# EAGLE board wordclock-r5-4x6 (EAGLE 5.11)
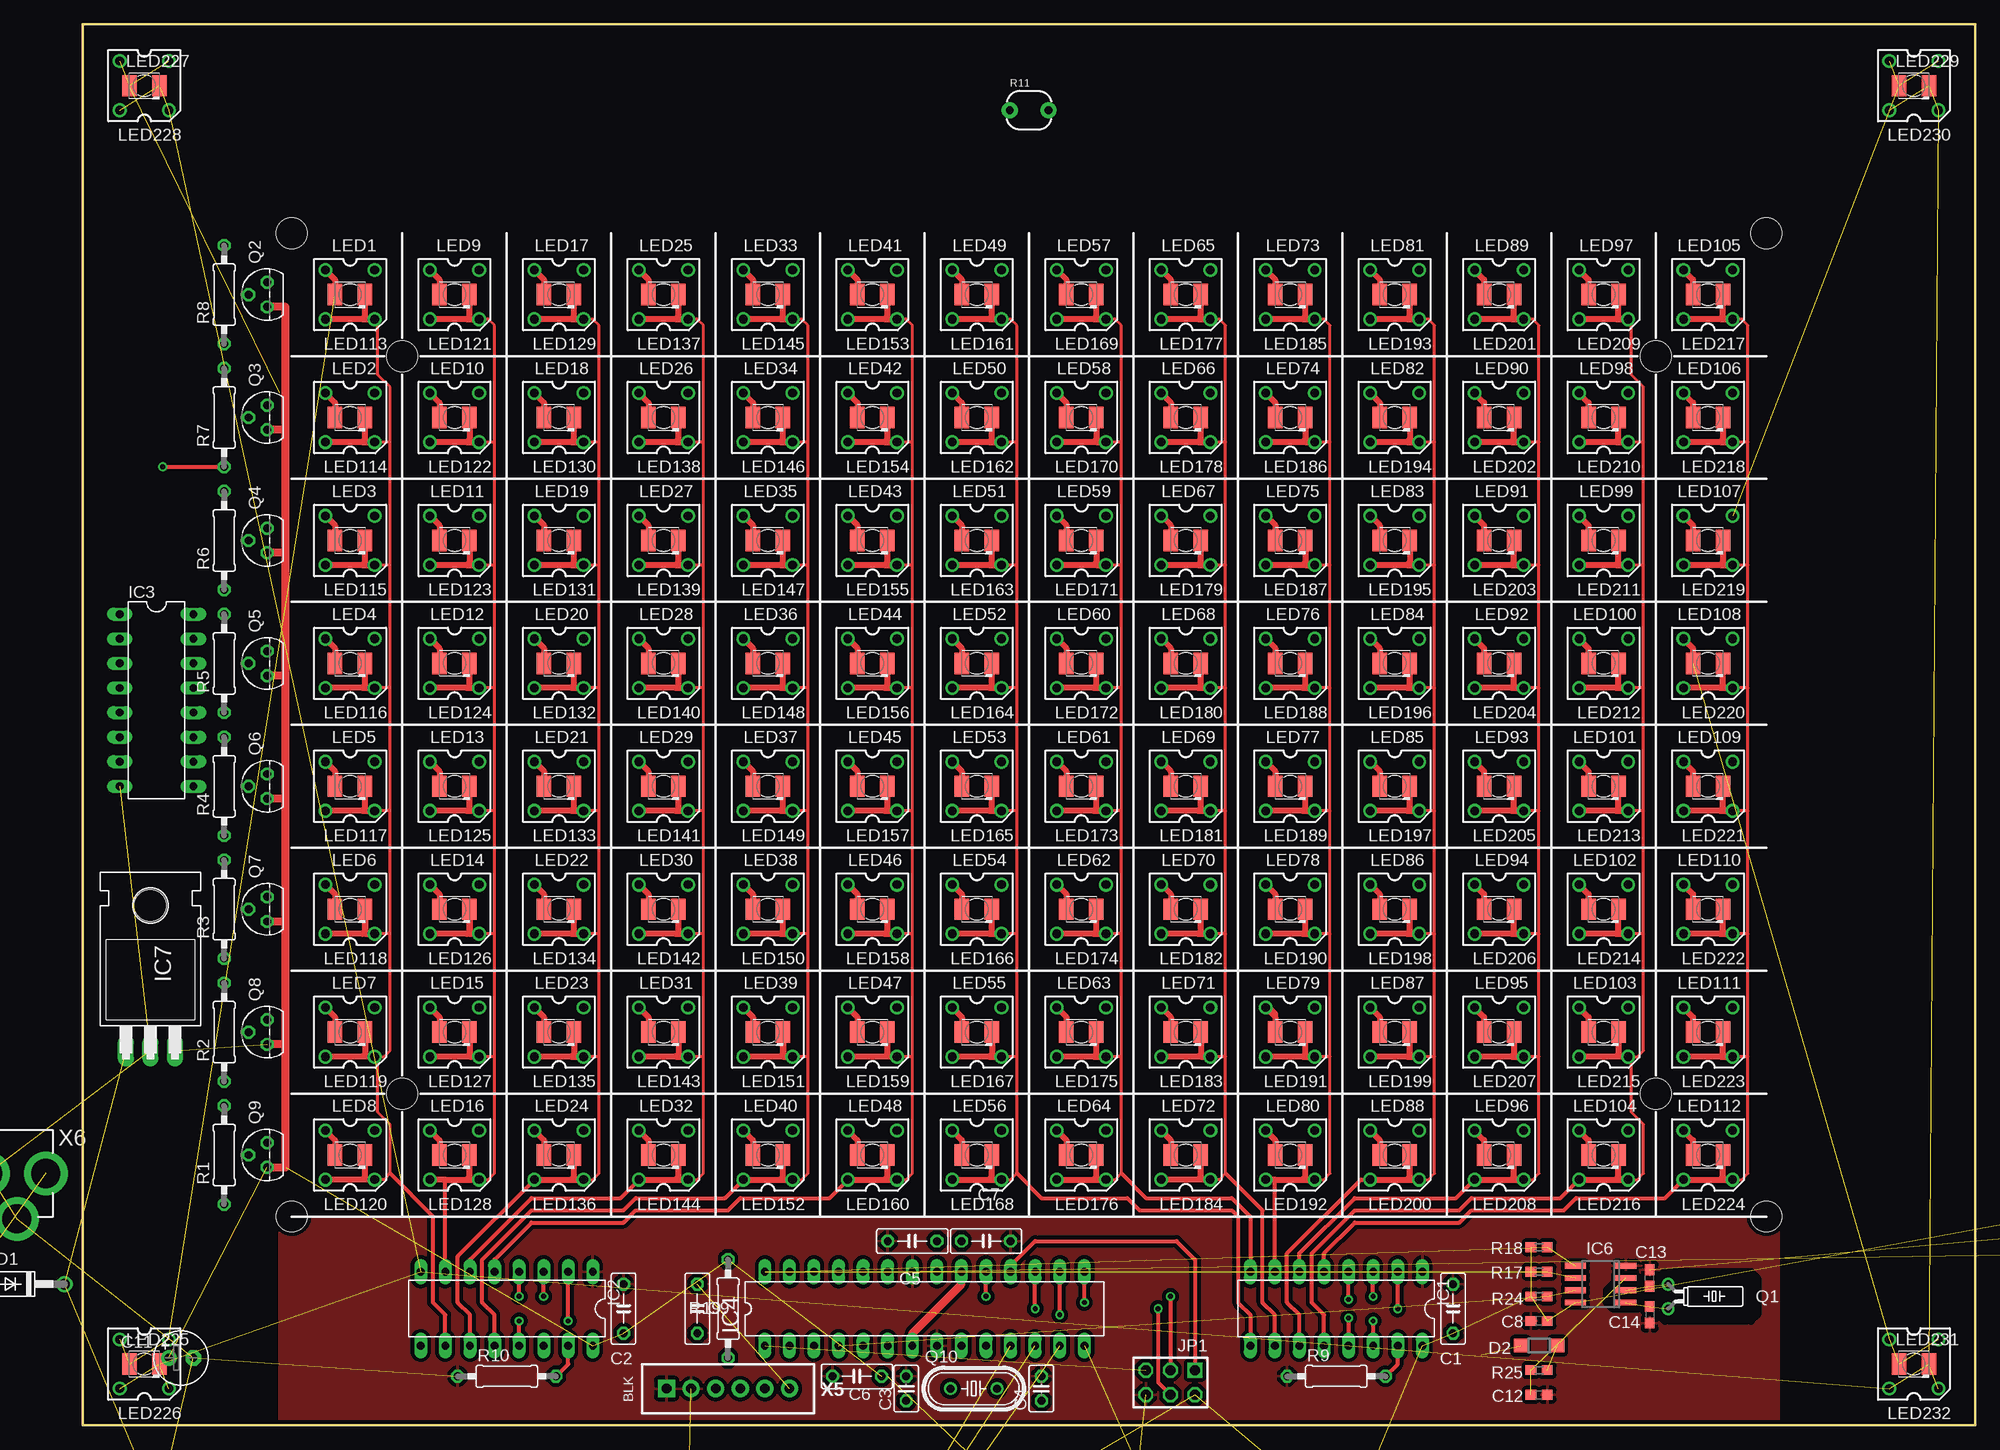
[diagram p2: board, top side]
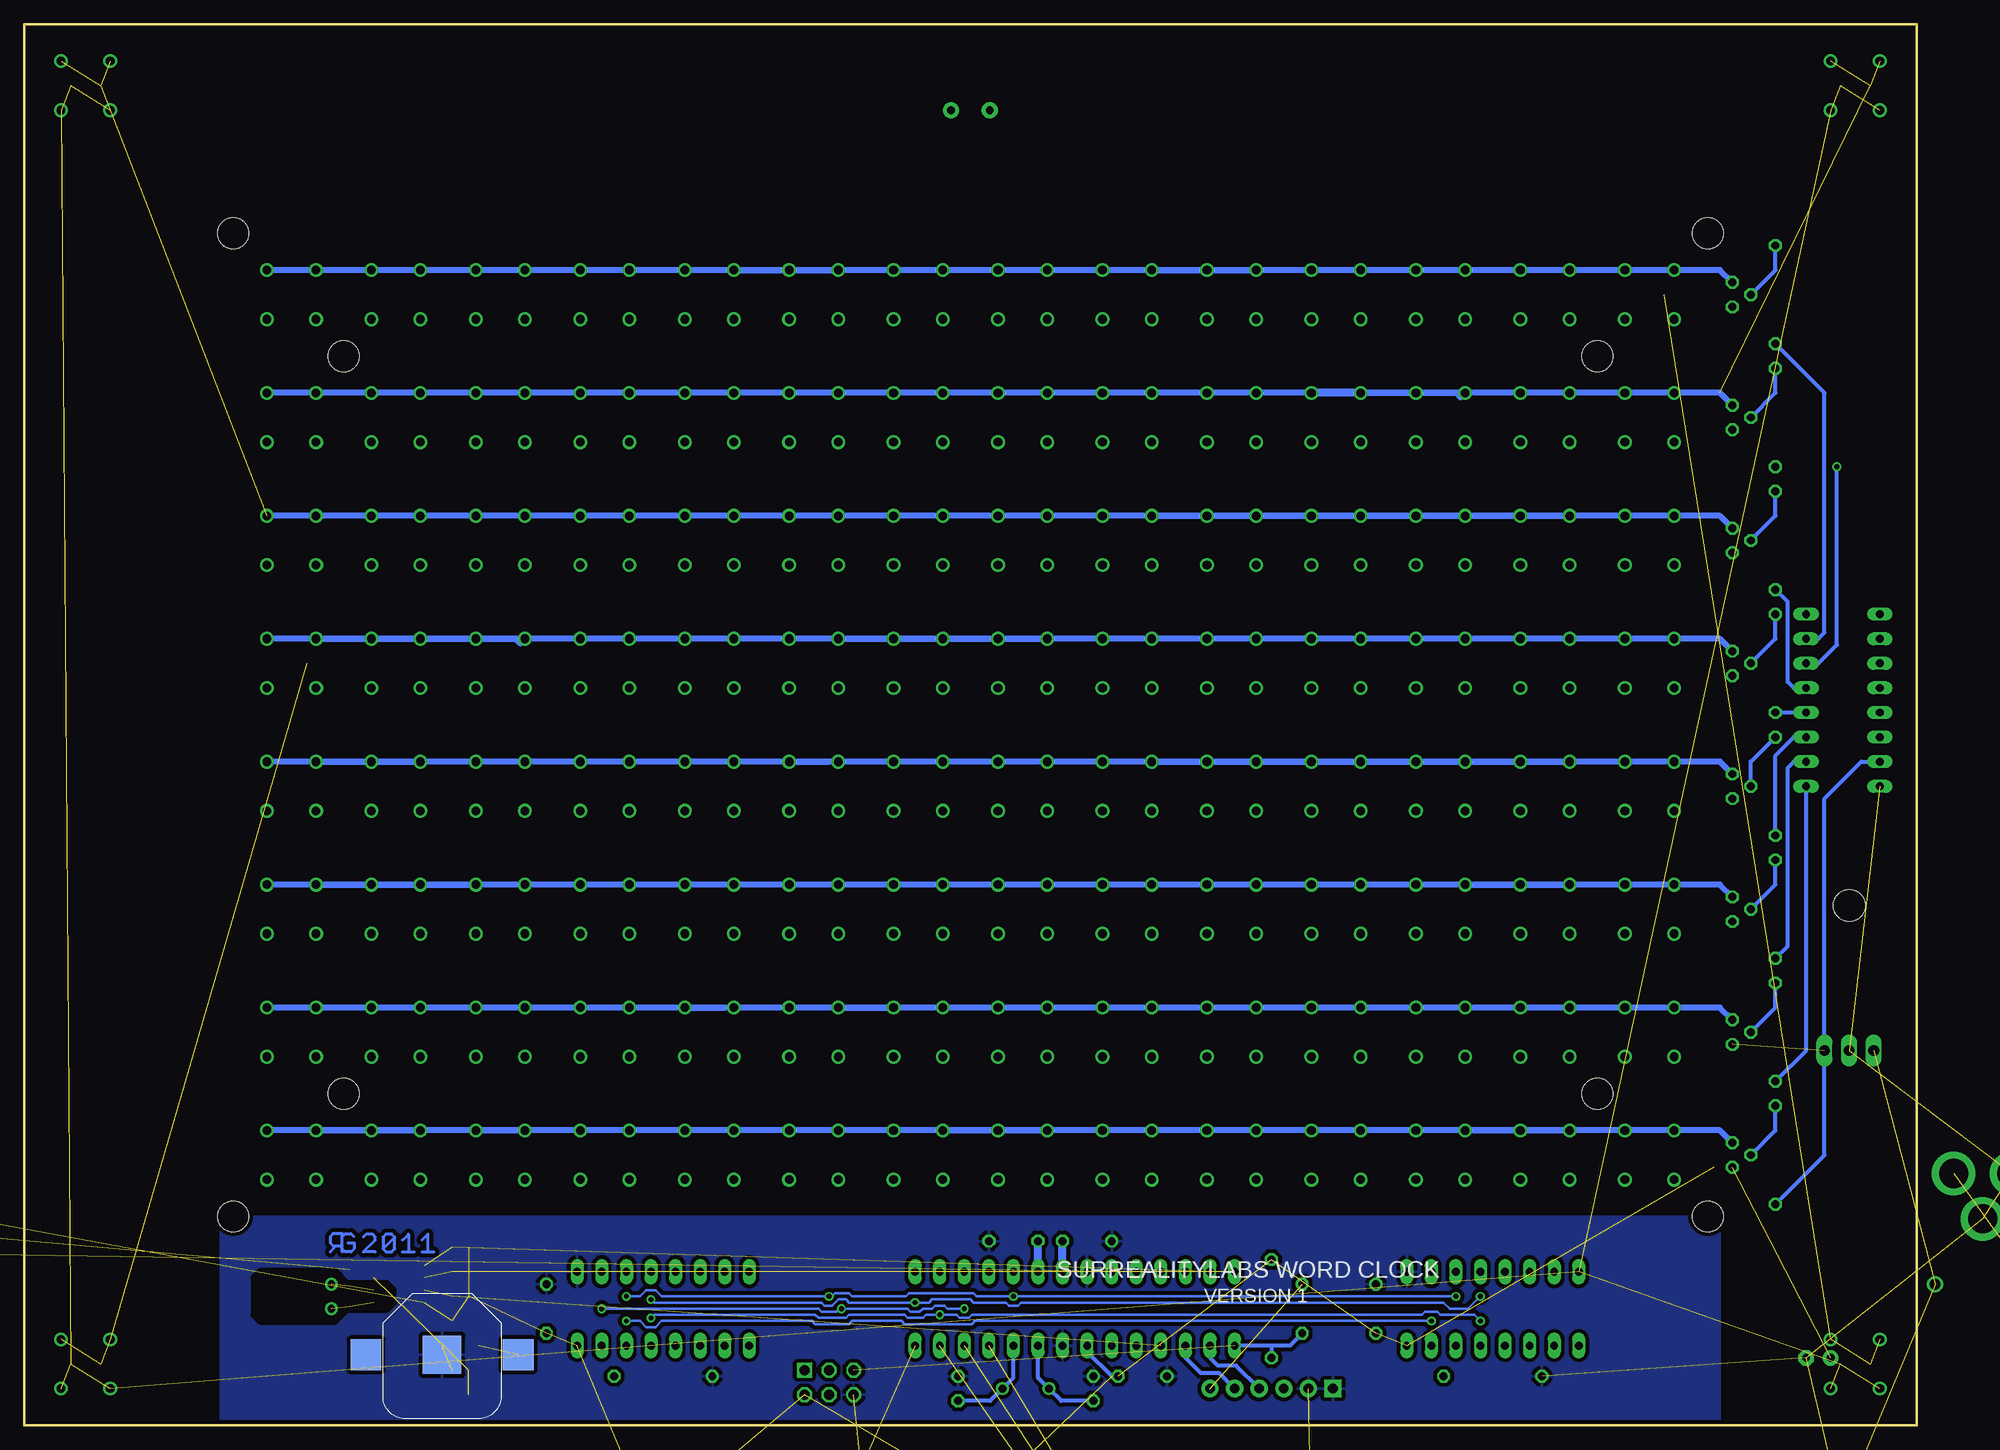
[diagram p3: board, bottom side, seen from below]

Size 195.58 x 144.78 mm. Coordinates in mm from the lower left corner, seen from the top.
Outline: 0,144.78 0,0 195.58,0 195.58,144.78 0,144.78
Copper layers (1*16): Top 0.035mm / dielectric 1.5mm / Bottom 0.035mm
Design rules "default *": minimum track width 10mil, minimum drill 19mil, track to track 10mil, track to pad 10mil, pad to pad 10mil, via to via 10mil, smd to smd 10mil, copper to edge 10mil, drill to drill 8mil, minimum pad ring 10mil, minimum via ring 8mil, stop-mask expansion 4mil, vias tented up to drill 20mil, thermal gap 16mil
Holes 3.2 mm at 21.59,123.19 173.99,123.19 173.99,21.59 21.59,21.59 33.02,34.29 162.56,34.29 162.56,110.49 33.02,110.49
tRestrict: 12 lines
bRestrict: 12 lines

## Footprints (pad centres in the part's own frame; a part is rotated, then mirrored left to right if it is on the bottom)
BATTCON_12MM = smd 3.962 x 3.962: GND 0,0 | smd 3.175 x 3.175: PWR@1 -7.874,0; PWR@2 7.874,0
C050-025X075 = drill 0.813 octagon: 1 -2.54,0; 2 2.54,0
C025-025X050 = drill 0.813 octagon: 1 -1.27,0; 2 1.27,0
C0603 = smd 1.1 x 1: 1 -0.85,0; 2 0.85,0
E3,5-8 = drill 0.813 pad 1.6 round: + -1.778,0 | drill 0.813 pad 1.6 octagon: - 1.778,0
E2,5-6 = drill 0.813 pad 1.6 round: + -1.27,0 | drill 0.813 pad 1.6 octagon: - 1.27,0
DO41-10 = drill 1.118 round: A 5.08,0; C -5.08,0
SOD123 = smd 1.4 x 1.4: A 1.9,0; C -1.9,0
DIP-16 = drill 0.813 long: 1 -8.89,-3.81; 2 -6.35,-3.81; 3 -3.81,-3.81; 4 -1.27,-3.81; 5 1.27,-3.81; 6 3.81,-3.81; 7 6.35,-3.81; 8 8.89,-3.81; 9 8.89,3.81; 10 6.35,3.81; 11 3.81,3.81; 12 1.27,3.81; 13 -1.27,3.81; 14 -3.81,3.81; 15 -6.35,3.81; 16 -8.89,3.81
DIL16 = drill 0.813 long: 1 -8.89,-3.81; 2 -6.35,-3.81; 3 -3.81,-3.81; 4 -1.27,-3.81; 5 1.27,-3.81; 6 3.81,-3.81; 7 6.35,-3.81; 8 8.89,-3.81; 9 8.89,3.81; 10 6.35,3.81; 11 3.81,3.81; 12 1.27,3.81; 13 -1.27,3.81; 14 -3.81,3.81; 15 -6.35,3.81; 16 -8.89,3.81
DIL28-3 = drill 0.813 long: 1 -16.51,-3.81; 2 -13.97,-3.81; 3 -11.43,-3.81; 4 -8.89,-3.81; 5 -6.35,-3.81; 6 -3.81,-3.81; 7 -1.27,-3.81; 8 1.27,-3.81; 9 3.81,-3.81; 10 6.35,-3.81; 11 8.89,-3.81; 12 11.43,-3.81; 13 13.97,-3.81; 14 16.51,-3.81; 15 16.51,3.81; 16 13.97,3.81; 17 11.43,3.81; 18 8.89,3.81; 19 6.35,3.81; 20 3.81,3.81; 21 1.27,3.81; 22 -1.27,3.81; 23 -3.81,3.81; 24 -6.35,3.81; 25 -8.89,3.81; 26 -11.43,3.81; 27 -13.97,3.81; 28 -16.51,3.81
SOIC8 = smd 0.6 x 2.2: 1 -1.905,-2.6; 2 -0.635,-2.6; 3 0.635,-2.6; 4 1.905,-2.6; 5 1.905,2.6; 6 0.635,2.6; 7 -0.635,2.6; 8 -1.905,2.6
TO220H = drill 1.118 long: 1 -2.54,-10.16; 2 0,-10.16; 3 2.54,-10.16 | hole 3.302: 0,4.826
AVR-ISP-6 = drill 1.016 square: 1 -2.54,-1.27 | drill 1.016 octagon: 2 -2.54,1.27; 3 0,-1.27; 4 0,1.27; 5 2.54,-1.27; 6 2.54,1.27
KA-3528ASYC = smd 1.5 x 2.2: A -1.55,0; C 1.55,0
SUPERFLUX-7.6X7.6 = drill 0.9 pad 1.422 round: 1 -2.54,2.54; 2 2.54,2.54; 3 -2.54,-2.54; 4 2.54,-2.54
TC26H = drill 0.813 round: 1 -1.27,0; 2 1.27,0
TO92 = drill 0.813 octagon: 1 1.27,0; 2 0,1.905; 3 -1.27,0
HC49/S = drill 0.813 round: 1 -2.413,0; 2 2.413,0
0207/10 = drill 0.813 octagon: 1 -5.08,0; 2 5.08,0
PHOTOCELL = drill 0.8 pad 1.676 round: 1 -2,0; 2 2,0
R0603 = smd 1.1 x 1: 1 -0.85,0; 2 0.85,0
B3F-31XX = drill 1.016 octagon: 1 -2.261,-1.245; 2 2.261,-1.245 | drill 1.499 pad 2.159 round: 3 -3.505,1.245; 4 3.505,1.245
USBCABLE-0.100-NOLBL = drill 1 pad 1.778 square: 1 0,-7.62 | drill 1 pad 1.778 round: 2 0,-5.08; 3 0,-2.54; 4 0,0; 5 0,2.54; 6 0,5.08
PJ-002 = drill 3 pad 4.5 round: 1 0,0; 2 0,6; 3 -4.7,3
22-23-2031 = drill 1 long: 1 -2.54,0; 2 0,0; 3 2.54,0

## Placement (x,y rotation side)
BAT1  [BATTCON_12MM]  152.4,7.3 180 bottom
C1  [C050-025X075]  141.6,12.06 90 top
C2  [C050-025X075]  55.88,12.06 90 top
C3  [C025-025X050]  85.09,3.81 90 top
C4  [C025-025X050]  99.06,3.81 90 top
C5  [C050-025X075]  85.73,19.05 180 top
C6  [C050-025X075]  80.01,5.08 180 top
C7  [C050-025X075]  93.34,19.05 0 top
C8  [C0603]  150.5,10.79 180 top
C9  [C050-025X075]  63.5,12.06 270 top
C10  100u  [E3,5-8]  8.25,-13.97 180 top  (outside the outline)
C11  10u  [E2,5-6]  10.16,6.98 0 top
C12  [C0603]  150.5,3.18 0 top
C13  8p  [C0603]  161.93,15.24 90 top
C14  10p  [C0603]  161.93,11.43 270 top
C15  10u  [E2,5-6]  211.46,6.98 0 top  (outside the outline)
D1  1N4004  [DO41-10]  -6.98,14.61 180 top
D2  MBR0520LT  [SOD123]  150.5,8.25 180 top
IC1  A6275EA  [DIP-16]  129.54,12.06 180 top
IC2  A6275EA  [DIP-16]  43.81,12.06 180 top
IC3  74LS138N  [DIL16]  7.62,74.93 270 top
IC4  MEGA48/88/168-PU  [DIL28-3]  87,12.06 0 top
IC6  DS1307Z  [SOIC8]  156.84,14.61 90 top
IC7  7805T  [TO220H]  6.98,48.89 0 top
JP1  AVR-ISP-6  [AVR-ISP-6]  112.4,4.45 180 top
LED1  [KA-3528ASYC]  27.62,116.84 0 top
LED2  [KA-3528ASYC]  27.62,104.14 0 top
LED3  [KA-3528ASYC]  27.62,91.44 0 top
LED4  [KA-3528ASYC]  27.62,78.74 0 top
LED5  [KA-3528ASYC]  27.62,66.04 0 top
LED6  [KA-3528ASYC]  27.62,53.34 0 top
LED7  [KA-3528ASYC]  27.62,40.64 0 top
LED8  [KA-3528ASYC]  27.62,27.94 0 top
LED9  [KA-3528ASYC]  38.42,116.84 0 top
LED10  [KA-3528ASYC]  38.42,104.14 0 top
LED11  [KA-3528ASYC]  38.42,91.44 0 top
LED12  [KA-3528ASYC]  38.42,78.74 0 top
LED13  [KA-3528ASYC]  38.42,66.04 0 top
LED14  [KA-3528ASYC]  38.42,53.34 0 top
LED15  [KA-3528ASYC]  38.42,40.64 0 top
LED16  [KA-3528ASYC]  38.42,27.94 0 top
LED17  [KA-3528ASYC]  49.21,116.84 0 top
LED18  [KA-3528ASYC]  49.21,104.14 0 top
LED19  [KA-3528ASYC]  49.21,91.44 0 top
LED20  [KA-3528ASYC]  49.21,78.74 0 top
LED21  [KA-3528ASYC]  49.21,66.04 0 top
LED22  [KA-3528ASYC]  49.21,53.34 0 top
LED23  [KA-3528ASYC]  49.21,40.64 0 top
LED24  [KA-3528ASYC]  49.21,27.94 0 top
LED25  [KA-3528ASYC]  60.01,116.84 0 top
LED26  [KA-3528ASYC]  60.01,104.14 0 top
LED27  [KA-3528ASYC]  60.01,91.44 0 top
LED28  [KA-3528ASYC]  60.01,78.74 0 top
LED29  [KA-3528ASYC]  60.01,66.04 0 top
LED30  [KA-3528ASYC]  60.01,53.34 0 top
LED31  [KA-3528ASYC]  60.01,40.64 0 top
LED32  [KA-3528ASYC]  60.01,27.94 0 top
LED33  [KA-3528ASYC]  70.8,116.84 0 top
LED34  [KA-3528ASYC]  70.8,104.14 0 top
LED35  [KA-3528ASYC]  70.8,91.44 0 top
LED36  [KA-3528ASYC]  70.8,78.74 0 top
LED37  [KA-3528ASYC]  70.8,66.04 0 top
LED38  [KA-3528ASYC]  70.8,53.34 0 top
LED39  [KA-3528ASYC]  70.8,40.64 0 top
LED40  [KA-3528ASYC]  70.8,27.94 0 top
LED41  [KA-3528ASYC]  81.6,116.84 0 top
LED42  [KA-3528ASYC]  81.6,104.14 0 top
LED43  [KA-3528ASYC]  81.6,91.44 0 top
LED44  [KA-3528ASYC]  81.6,78.74 0 top
LED45  [KA-3528ASYC]  81.6,66.04 0 top
LED46  [KA-3528ASYC]  81.6,53.34 0 top
LED47  [KA-3528ASYC]  81.6,40.64 0 top
LED48  [KA-3528ASYC]  81.6,27.94 0 top
LED49  [KA-3528ASYC]  92.39,116.84 0 top
LED50  [KA-3528ASYC]  92.39,104.14 0 top
LED51  [KA-3528ASYC]  92.39,91.44 0 top
LED52  [KA-3528ASYC]  92.39,78.74 0 top
LED53  [KA-3528ASYC]  92.39,66.04 0 top
LED54  [KA-3528ASYC]  92.39,53.34 0 top
LED55  [KA-3528ASYC]  92.39,40.64 0 top
LED56  [KA-3528ASYC]  92.39,27.94 0 top
LED57  [KA-3528ASYC]  103.19,116.84 0 top
LED58  [KA-3528ASYC]  103.19,104.14 0 top
LED59  [KA-3528ASYC]  103.19,91.44 0 top
LED60  [KA-3528ASYC]  103.19,78.74 0 top
LED61  [KA-3528ASYC]  103.19,66.04 0 top
LED62  [KA-3528ASYC]  103.19,53.34 0 top
LED63  [KA-3528ASYC]  103.19,40.64 0 top
LED64  [KA-3528ASYC]  103.19,27.94 0 top
LED65  [KA-3528ASYC]  113.98,116.84 0 top
LED66  [KA-3528ASYC]  113.98,104.14 0 top
LED67  [KA-3528ASYC]  113.98,91.44 0 top
LED68  [KA-3528ASYC]  113.98,78.74 0 top
LED69  [KA-3528ASYC]  113.98,66.04 0 top
LED70  [KA-3528ASYC]  113.98,53.34 0 top
LED71  [KA-3528ASYC]  113.98,40.64 0 top
LED72  [KA-3528ASYC]  113.98,27.94 0 top
LED73  [KA-3528ASYC]  124.78,116.84 0 top
LED74  [KA-3528ASYC]  124.78,104.14 0 top
LED75  [KA-3528ASYC]  124.78,91.44 0 top
LED76  [KA-3528ASYC]  124.78,78.74 0 top
LED77  [KA-3528ASYC]  124.78,66.04 0 top
LED78  [KA-3528ASYC]  124.78,53.34 0 top
LED79  [KA-3528ASYC]  124.78,40.64 0 top
LED80  [KA-3528ASYC]  124.78,27.94 0 top
LED81  [KA-3528ASYC]  135.57,116.84 0 top
LED82  [KA-3528ASYC]  135.57,104.14 0 top
LED83  [KA-3528ASYC]  135.57,91.44 0 top
LED84  [KA-3528ASYC]  135.57,78.74 0 top
LED85  [KA-3528ASYC]  135.57,66.04 0 top
LED86  [KA-3528ASYC]  135.57,53.34 0 top
LED87  [KA-3528ASYC]  135.57,40.64 0 top
LED88  [KA-3528ASYC]  135.57,27.94 0 top
LED89  [KA-3528ASYC]  146.37,116.84 0 top
LED90  [KA-3528ASYC]  146.37,104.14 0 top
LED91  [KA-3528ASYC]  146.37,91.44 0 top
LED92  [KA-3528ASYC]  146.37,78.74 0 top
LED93  [KA-3528ASYC]  146.37,66.04 0 top
LED94  [KA-3528ASYC]  146.37,53.34 0 top
LED95  [KA-3528ASYC]  146.37,40.64 0 top
LED96  [KA-3528ASYC]  146.37,27.94 0 top
LED97  [KA-3528ASYC]  157.16,116.84 0 top
LED98  [KA-3528ASYC]  157.16,104.14 0 top
LED99  [KA-3528ASYC]  157.16,91.44 0 top
LED100  [KA-3528ASYC]  157.16,78.74 0 top
LED101  [KA-3528ASYC]  157.16,66.04 0 top
LED102  [KA-3528ASYC]  157.16,53.34 0 top
LED103  [KA-3528ASYC]  157.16,40.64 0 top
LED104  [KA-3528ASYC]  157.16,27.94 0 top
LED105  [KA-3528ASYC]  167.96,116.84 0 top
LED106  [KA-3528ASYC]  167.96,104.14 0 top
LED107  [KA-3528ASYC]  167.96,91.44 0 top
LED108  [KA-3528ASYC]  167.96,78.74 0 top
LED109  [KA-3528ASYC]  167.96,66.04 0 top
LED110  [KA-3528ASYC]  167.96,53.34 0 top
LED111  [KA-3528ASYC]  167.96,40.64 0 top
LED112  [KA-3528ASYC]  167.96,27.94 0 top
LED113  [SUPERFLUX-7.6X7.6]  27.62,116.84 90 top
LED114  [SUPERFLUX-7.6X7.6]  27.62,104.14 90 top
LED115  [SUPERFLUX-7.6X7.6]  27.62,91.44 90 top
LED116  [SUPERFLUX-7.6X7.6]  27.62,78.74 90 top
LED117  [SUPERFLUX-7.6X7.6]  27.62,66.04 90 top
LED118  [SUPERFLUX-7.6X7.6]  27.62,53.34 90 top
LED119  [SUPERFLUX-7.6X7.6]  27.62,40.64 90 top
LED120  [SUPERFLUX-7.6X7.6]  27.62,27.94 90 top
LED121  [SUPERFLUX-7.6X7.6]  38.42,116.84 90 top
LED122  [SUPERFLUX-7.6X7.6]  38.42,104.14 90 top
LED123  [SUPERFLUX-7.6X7.6]  38.42,91.44 90 top
LED124  [SUPERFLUX-7.6X7.6]  38.42,78.74 90 top
LED125  [SUPERFLUX-7.6X7.6]  38.42,66.04 90 top
LED126  [SUPERFLUX-7.6X7.6]  38.42,53.34 90 top
LED127  [SUPERFLUX-7.6X7.6]  38.42,40.64 90 top
LED128  [SUPERFLUX-7.6X7.6]  38.42,27.94 90 top
LED129  [SUPERFLUX-7.6X7.6]  49.21,116.84 90 top
LED130  [SUPERFLUX-7.6X7.6]  49.21,104.14 90 top
LED131  [SUPERFLUX-7.6X7.6]  49.21,91.44 90 top
LED132  [SUPERFLUX-7.6X7.6]  49.21,78.74 90 top
LED133  [SUPERFLUX-7.6X7.6]  49.21,66.04 90 top
LED134  [SUPERFLUX-7.6X7.6]  49.21,53.34 90 top
LED135  [SUPERFLUX-7.6X7.6]  49.21,40.64 90 top
LED136  [SUPERFLUX-7.6X7.6]  49.21,27.94 90 top
LED137  [SUPERFLUX-7.6X7.6]  60.01,116.84 90 top
LED138  [SUPERFLUX-7.6X7.6]  60.01,104.14 90 top
LED139  [SUPERFLUX-7.6X7.6]  60.01,91.44 90 top
LED140  [SUPERFLUX-7.6X7.6]  60.01,78.74 90 top
LED141  [SUPERFLUX-7.6X7.6]  60.01,66.04 90 top
LED142  [SUPERFLUX-7.6X7.6]  60.01,53.34 90 top
LED143  [SUPERFLUX-7.6X7.6]  60.01,40.64 90 top
LED144  [SUPERFLUX-7.6X7.6]  60.01,27.94 90 top
LED145  [SUPERFLUX-7.6X7.6]  70.8,116.84 90 top
LED146  [SUPERFLUX-7.6X7.6]  70.8,104.14 90 top
LED147  [SUPERFLUX-7.6X7.6]  70.8,91.44 90 top
LED148  [SUPERFLUX-7.6X7.6]  70.8,78.74 90 top
LED149  [SUPERFLUX-7.6X7.6]  70.8,66.04 90 top
LED150  [SUPERFLUX-7.6X7.6]  70.8,53.34 90 top
LED151  [SUPERFLUX-7.6X7.6]  70.8,40.64 90 top
LED152  [SUPERFLUX-7.6X7.6]  70.8,27.94 90 top
LED153  [SUPERFLUX-7.6X7.6]  81.6,116.84 90 top
LED154  [SUPERFLUX-7.6X7.6]  81.6,104.14 90 top
LED155  [SUPERFLUX-7.6X7.6]  81.6,91.44 90 top
LED156  [SUPERFLUX-7.6X7.6]  81.6,78.74 90 top
LED157  [SUPERFLUX-7.6X7.6]  81.6,66.04 90 top
LED158  [SUPERFLUX-7.6X7.6]  81.6,53.34 90 top
LED159  [SUPERFLUX-7.6X7.6]  81.6,40.64 90 top
LED160  [SUPERFLUX-7.6X7.6]  81.6,27.94 90 top
LED161  [SUPERFLUX-7.6X7.6]  92.39,116.84 90 top
LED162  [SUPERFLUX-7.6X7.6]  92.39,104.14 90 top
LED163  [SUPERFLUX-7.6X7.6]  92.39,91.44 90 top
LED164  [SUPERFLUX-7.6X7.6]  92.39,78.74 90 top
LED165  [SUPERFLUX-7.6X7.6]  92.39,66.04 90 top
LED166  [SUPERFLUX-7.6X7.6]  92.39,53.34 90 top
LED167  [SUPERFLUX-7.6X7.6]  92.39,40.64 90 top
LED168  [SUPERFLUX-7.6X7.6]  92.39,27.94 90 top
LED169  [SUPERFLUX-7.6X7.6]  103.19,116.84 90 top
LED170  [SUPERFLUX-7.6X7.6]  103.19,104.14 90 top
LED171  [SUPERFLUX-7.6X7.6]  103.19,91.44 90 top
LED172  [SUPERFLUX-7.6X7.6]  103.19,78.74 90 top
LED173  [SUPERFLUX-7.6X7.6]  103.19,66.04 90 top
LED174  [SUPERFLUX-7.6X7.6]  103.19,53.34 90 top
LED175  [SUPERFLUX-7.6X7.6]  103.19,40.64 90 top
LED176  [SUPERFLUX-7.6X7.6]  103.19,27.94 90 top
LED177  [SUPERFLUX-7.6X7.6]  113.98,116.84 90 top
LED178  [SUPERFLUX-7.6X7.6]  113.98,104.14 90 top
LED179  [SUPERFLUX-7.6X7.6]  113.98,91.44 90 top
LED180  [SUPERFLUX-7.6X7.6]  113.98,78.74 90 top
LED181  [SUPERFLUX-7.6X7.6]  113.98,66.04 90 top
LED182  [SUPERFLUX-7.6X7.6]  113.98,53.34 90 top
LED183  [SUPERFLUX-7.6X7.6]  113.98,40.64 90 top
LED184  [SUPERFLUX-7.6X7.6]  113.98,27.94 90 top
LED185  [SUPERFLUX-7.6X7.6]  124.78,116.84 90 top
LED186  [SUPERFLUX-7.6X7.6]  124.78,104.14 90 top
LED187  [SUPERFLUX-7.6X7.6]  124.78,91.44 90 top
LED188  [SUPERFLUX-7.6X7.6]  124.78,78.74 90 top
LED189  [SUPERFLUX-7.6X7.6]  124.78,66.04 90 top
LED190  [SUPERFLUX-7.6X7.6]  124.78,53.34 90 top
LED191  [SUPERFLUX-7.6X7.6]  124.78,40.64 90 top
LED192  [SUPERFLUX-7.6X7.6]  124.78,27.94 90 top
LED193  [SUPERFLUX-7.6X7.6]  135.57,116.84 90 top
LED194  [SUPERFLUX-7.6X7.6]  135.57,104.14 90 top
LED195  [SUPERFLUX-7.6X7.6]  135.57,91.44 90 top
LED196  [SUPERFLUX-7.6X7.6]  135.57,78.74 90 top
LED197  [SUPERFLUX-7.6X7.6]  135.57,66.04 90 top
LED198  [SUPERFLUX-7.6X7.6]  135.57,53.34 90 top
LED199  [SUPERFLUX-7.6X7.6]  135.57,40.64 90 top
LED200  [SUPERFLUX-7.6X7.6]  135.57,27.94 90 top
LED201  [SUPERFLUX-7.6X7.6]  146.37,116.84 90 top
LED202  [SUPERFLUX-7.6X7.6]  146.37,104.14 90 top
LED203  [SUPERFLUX-7.6X7.6]  146.37,91.44 90 top
LED204  [SUPERFLUX-7.6X7.6]  146.37,78.74 90 top
LED205  [SUPERFLUX-7.6X7.6]  146.37,66.04 90 top
LED206  [SUPERFLUX-7.6X7.6]  146.37,53.34 90 top
LED207  [SUPERFLUX-7.6X7.6]  146.37,40.64 90 top
LED208  [SUPERFLUX-7.6X7.6]  146.37,27.94 90 top
LED209  [SUPERFLUX-7.6X7.6]  157.16,116.84 90 top
LED210  [SUPERFLUX-7.6X7.6]  157.16,104.14 90 top
LED211  [SUPERFLUX-7.6X7.6]  157.16,91.44 90 top
LED212  [SUPERFLUX-7.6X7.6]  157.16,78.74 90 top
LED213  [SUPERFLUX-7.6X7.6]  157.16,66.04 90 top
LED214  [SUPERFLUX-7.6X7.6]  157.16,53.34 90 top
LED215  [SUPERFLUX-7.6X7.6]  157.16,40.64 90 top
LED216  [SUPERFLUX-7.6X7.6]  157.16,27.94 90 top
LED217  [SUPERFLUX-7.6X7.6]  167.96,116.84 90 top
LED218  [SUPERFLUX-7.6X7.6]  167.96,104.14 90 top
LED219  [SUPERFLUX-7.6X7.6]  167.96,91.44 90 top
LED220  [SUPERFLUX-7.6X7.6]  167.96,78.74 90 top
LED221  [SUPERFLUX-7.6X7.6]  167.96,66.04 90 top
LED222  [SUPERFLUX-7.6X7.6]  167.96,53.34 90 top
LED223  [SUPERFLUX-7.6X7.6]  167.96,40.64 90 top
LED224  [SUPERFLUX-7.6X7.6]  167.96,27.94 90 top
LED225  [KA-3528ASYC]  6.35,6.35 0 top
LED226  [SUPERFLUX-7.6X7.6]  6.35,6.35 90 top
LED227  [KA-3528ASYC]  6.35,138.43 0 top
LED228  [SUPERFLUX-7.6X7.6]  6.35,138.43 90 top
LED229  [KA-3528ASYC]  189.23,138.43 0 top
LED230  [SUPERFLUX-7.6X7.6]  189.23,138.43 90 top
LED231  [KA-3528ASYC]  189.23,6.35 0 top
LED232  [SUPERFLUX-7.6X7.6]  189.23,6.35 90 top
Q1  [TC26H]  163.83,13.33 270 top
Q2  2N3906  [TO92]  19.05,116.84 90 top
Q3  2N3906  [TO92]  19.05,104.14 90 top
Q4  2N3906  [TO92]  19.05,91.44 90 top
Q5  2N3906  [TO92]  19.05,78.74 90 top
Q6  2N3906  [TO92]  19.05,66.04 90 top
Q7  2N3906  [TO92]  19.05,53.34 90 top
Q8  2N3906  [TO92]  19.05,40.64 90 top
Q9  2N3906  [TO92]  19.05,27.94 90 top
Q10  [HC49/S]  92.08,3.81 0 top
R1  [0207/10]  14.61,27.94 90 top
R2  [0207/10]  14.61,40.64 90 top
R3  [0207/10]  14.61,53.34 90 top
R4  [0207/10]  14.61,66.04 90 top
R5  [0207/10]  14.61,78.74 90 top
R6  [0207/10]  14.61,91.44 90 top
R7  [0207/10]  14.61,104.14 90 top
R8  [0207/10]  14.61,116.84 90 top
R9  [0207/10]  129.54,5.08 0 top
R10  [0207/10]  43.81,5.08 0 top
R11  PHOTOCELLPTH  [PHOTOCELL]  97.79,135.89 0 top
R17  [R0603]  150.5,15.88 180 top
R18  [R0603]  150.5,18.41 180 top
R19  [0207/10]  66.67,12.06 90 top
R20  [0207/10]  91.44,-7.62 0 top  (outside the outline)
R21  [0207/10]  91.44,-10.16 0 top  (outside the outline)
R22  [0207/10]  91.44,-12.7 0 top  (outside the outline)
R23  [0207/10]  125.73,-10.16 0 top  (outside the outline)
R24  [R0603]  150.5,13.33 180 top
R25  [R0603]  150.5,5.71 0 top
S1  [B3F-31XX]  53.34,-11.43 0 top  (outside the outline)
S2  [B3F-31XX]  64.77,-11.43 0 top  (outside the outline)
S3  [B3F-31XX]  76.2,-11.43 0 top  (outside the outline)
S4  [B3F-31XX]  110.49,-11.43 0 top  (outside the outline)
U$1  [RGLOGO_SMALL_2011]  162.56,17.78 0 bottom
U$2  [SURREALITY_LOGO_SILK]  77.47,-7.62 0 bottom  (outside the outline)
X5  TTL-232R-5VN  [USBCABLE-0.100-NOLBL]  67.94,3.81 270 top
X6  PJ-002B  [PJ-002]  -3.81,26.04 90 top  (outside the outline)
X7  22-23-2031  [22-23-2031]  209.55,20.32 270 top  (outside the outline)

## Tracks (layer width: path | path; a pad name or v marks a point on that pad's centre or on a via)
+5V  (20 unrouted)
  Top 0.813: Q2.3 20.95,115.57 20.95,102.87 | 20.95,39.37 20.95,26.67 Q9.3 | 20.95,39.37 20.95,52.07 | 20.95,52.07 20.95,64.77 | 20.95,64.77 20.95,77.47 | 20.95,77.47 20.95,90.17 | 20.95,90.17 20.95,102.87 | 20.95,39.37 Q8.3 | 20.95,52.07 Q7.3 | 20.95,64.77 Q6.3 | 20.95,77.47 Q5.3 | 20.95,90.17 Q4.3 | 20.95,102.87 Q3.3 | IC4.20 90.81,14.61 85.73,9.53 IC4.7
  Bottom 0.406: C6.1 83.19,5.08 85.73,7.62 IC4.7
  Bottom 0.813: IC4.20 C7.1
BRIGHT  (via drill 0.5)
  Top 0.406: IC2.13 v45.09,10.79 | v100.97,11.43 IC4.16 | v130.81,11.11 IC1.13
  Bottom 0.254: v45.09,10.79 45.72,11.43 49.21,11.43 49.53,11.75 50.8,11.75 51.12,11.43 97.63,11.43 97.95,11.11 98.9,11.11 99.22,11.43 v100.97,11.43 102.39,11.43 102.71,11.11 104.3,11.11 104.62,11.43 110.33,11.43 110.65,11.11 113.51,11.11 113.82,11.43 130.49,11.43 v130.81,11.11
BUTTON1  (2 unrouted)
BUTTON2  (2 unrouted)
BUTTON3  (2 unrouted)
BUTTON4  (2 unrouted)
COL1
  Top 0.305: 169.23,114.3 171.45,114.3 172.09,113.67 172.09,101.6 | 172.09,38.1 172.09,26.04 171.45,25.4 LED224.3 | 172.09,38.1 172.09,50.8 | 172.09,50.8 172.09,63.5 | 172.09,63.5 172.09,76.2 | 172.09,76.2 172.09,88.9 | 172.09,88.9 172.09,101.6 | 172.09,38.1 169.23,38.1 | 172.09,38.1 | 172.09,50.8 169.23,50.8 | 172.09,50.8 | 172.09,63.5 169.23,63.5 | 172.09,76.2 169.23,76.2 | 172.09,76.2 | LED107.C 169.51,88.94 169.55,88.9 172.09,88.9 | LED106.C 169.51,101.64 169.55,101.6 172.09,101.6
  Top 0.406: IC1.5 128.27,17.78 131.44,20.95 142.24,20.95 143.51,22.23 153.03,22.23 154.31,23.5 163.51,23.5 LED224.1
  Top 0.61: 169.23,101.6 LED218.1 | 169.23,101.6 LED218.3 | LED106.C 169.51,101.88 169.23,101.6 | 169.23,114.3 LED217.1 | 169.23,114.3 LED217.3 | LED105.C 169.51,114.58 169.23,114.3 | 169.23,50.8 LED222.1 | 169.23,50.8 LED222.3 | 169.23,38.1 LED223.1 | 169.23,38.1 LED223.3 | LED224.1 169.23,25.4 | 169.23,25.4 LED224.3 | LED110.C 169.51,51.08 169.23,50.8 | LED111.C 169.51,38.38 169.23,38.1 | LED112.C 169.51,25.68 169.23,25.4 | 169.23,88.9 LED219.3 | 169.23,88.9 LED219.1 | 169.23,76.2 LED220.1 | 169.23,76.2 LED220.3 | 169.23,63.5 LED221.1 | 169.23,63.5 LED221.3 | LED107.C 169.51,89.18 169.23,88.9 | LED108.C 169.51,76.48 169.23,76.2 | LED109.C 169.51,63.78 169.23,63.5
COL2
  Top 0.305: 158.43,114.3 160.02,114.3 160.02,108.59 161.29,107.31 161.29,101.6 | 161.29,50.8 161.29,63.5 | 161.29,63.5 161.29,76.2 | 161.29,76.2 161.29,88.9 | 161.29,88.9 161.29,101.6 | LED216.3 160.66,25.4 161.29,26.04 161.29,31.12 160.02,32.38 160.02,37.78 LED215.3 160.66,38.1 161.29,38.73 161.29,50.8 | LED216.3 | 161.29,101.6 158.43,101.6 | 161.29,101.6 | 161.29,88.9 158.43,88.9 | 161.29,88.9 | 161.29,76.2 158.43,76.2 | 161.29,63.5 158.43,63.5 | 161.29,63.5 | 161.29,50.8 158.43,50.8 | LED103.C 158.71,38.14 158.75,38.1
  Top 0.406: IC1.12 128.27,11.43 127,12.7 127,17.78 131.44,22.23 142.24,22.23 143.51,23.5 152.72,23.5 LED216.1
  Top 0.61: 158.43,101.6 LED210.1 | 158.43,101.6 LED210.3 | LED98.C 158.71,101.88 158.43,101.6 | 158.43,114.3 LED209.1 | 158.43,114.3 LED209.3 | LED97.C 158.71,114.58 158.43,114.3 | 158.43,50.8 LED214.1 | 158.43,50.8 LED214.3 | LED216.1 158.43,25.4 | 158.43,25.4 LED216.3 | 158.43,38.1 LED215.1 | 158.43,38.1 158.75,38.1 LED215.3 | LED102.C 158.71,51.08 158.43,50.8 | LED103.C 158.71,38.38 158.43,38.1 | LED104.C 158.71,25.68 158.43,25.4 | 158.43,88.9 LED211.1 | 158.43,88.9 LED211.3 | 158.43,63.5 LED213.1 | 158.43,63.5 LED213.3 | 158.43,76.2 LED212.1 | 158.43,76.2 LED212.3 | LED101.C 158.71,63.78 158.43,63.5 | LED100.C 158.71,76.48 158.43,76.2 | LED99.C 158.71,89.18 158.43,88.9
COL3
  Top 0.305: 147.64,114.3 149.86,114.3 150.5,113.67 150.5,101.6 | 150.5,38.1 150.5,26.04 149.86,25.4 LED208.3 | 150.5,38.1 150.5,50.8 | 150.5,50.8 150.5,63.5 | 150.5,63.5 150.5,76.2 | 150.5,76.2 150.5,88.9 | 150.5,88.9 150.5,101.6 | 150.5,101.6 147.64,101.6 | 150.5,88.9 147.64,88.9 | 150.5,76.2 147.64,76.2 | 150.5,63.5 147.64,63.5 | 150.5,63.5 | 150.5,50.8 147.64,50.8 | LED95.C 147.92,38.14 147.95,38.1 150.5,38.1
  Top 0.406: IC1.6 125.73,17.78 131.44,23.5 141.92,23.5 LED208.1
  Top 0.61: 147.64,114.3 LED201.1 | 147.64,114.3 LED201.3 | LED89.C 147.92,114.58 147.64,114.3 | 147.64,101.6 LED202.1 | 147.64,101.6 LED202.3 | LED90.C 147.92,101.88 147.64,101.6 | 147.64,50.8 LED206.1 | 147.64,50.8 LED206.3 | LED208.1 147.64,25.4 | 147.64,25.4 LED208.3 | 147.64,38.1 LED207.1 | 147.64,38.1 LED207.3 | LED94.C 147.92,51.08 147.64,50.8 | LED95.C 147.92,38.38 147.64,38.1 | LED96.C 147.92,25.68 147.64,25.4 | 147.64,88.9 LED203.1 | 147.64,88.9 LED203.3 | 147.64,76.2 LED204.1 | 147.64,76.2 LED204.3 | 147.64,63.5 LED205.1 | 147.64,63.5 LED205.3 | LED91.C 147.92,89.18 147.64,88.9 | LED92.C 147.92,76.48 147.64,76.2 | LED93.C 147.92,63.78 147.64,63.5
COL4
  Top 0.305: 136.84,114.3 139.06,114.3 139.7,113.67 139.7,101.6 | 139.7,38.1 139.7,26.04 139.06,25.4 LED200.3 | 139.7,38.1 139.7,50.8 | 139.7,50.8 139.7,63.5 | 139.7,63.5 139.7,76.2 | 139.7,76.2 139.7,88.9 | 139.7,88.9 139.7,101.6 | 139.7,38.1 136.84,38.1 | 139.7,50.8 136.84,50.8 | 139.7,63.5 136.84,63.5 | 139.7,76.2 136.84,76.2 | LED83.C 137.12,88.94 137.16,88.9 139.7,88.9 | LED82.C 137.12,101.64 137.16,101.6 139.7,101.6
  Top 0.406: IC1.11 125.73,11.43 124.46,12.7 124.46,17.78 132.08,25.4 LED200.1 | LED200.1
  Top 0.61: 136.84,101.6 LED194.1 | 136.84,101.6 LED194.3 | LED82.C 137.12,101.88 136.84,101.6 | 136.84,114.3 LED193.1 | 136.84,114.3 LED193.3 | LED81.C 137.12,114.58 136.84,114.3 | LED200.1 136.84,25.4 | 136.84,25.4 LED200.3 | 136.84,38.1 LED199.1 | 136.84,38.1 LED199.3 | 136.84,50.8 LED198.1 | 136.84,50.8 LED198.3 | LED86.C 137.12,51.08 136.84,50.8 | LED87.C 137.12,38.38 136.84,38.1 | LED88.C 137.12,25.68 136.84,25.4 | 136.84,88.9 LED195.1 | 136.84,88.9 LED195.3 | 136.84,63.5 LED197.1 | 136.84,63.5 LED197.3 | 136.84,76.2 LED196.1 | 136.84,76.2 LED196.3 | LED85.C 137.12,63.78 136.84,63.5 | LED84.C 137.12,76.48 136.84,76.2 | LED83.C 137.12,89.18 136.84,88.9
COL5
  Top 0.305: 126.05,114.3 128.27,114.3 128.91,113.67 128.91,101.6 | 128.91,38.1 128.91,26.04 128.27,25.4 LED192.3 | 128.91,38.1 128.91,50.8 | 128.91,50.8 128.91,63.5 | 128.91,63.5 128.91,76.2 | 128.91,76.2 128.91,88.9 | 128.91,88.9 128.91,101.6 | LED192.3 | 128.91,38.1 126.05,38.1 | 128.91,38.1 | 128.91,50.8 126.05,50.8 | 128.91,50.8 | 128.91,63.5 126.05,63.5 | 128.91,76.2 126.05,76.2 | LED75.C 126.33,88.94 126.37,88.9 128.91,88.9 | LED74.C 126.33,101.64 126.37,101.6 128.91,101.6
  Top 0.406: IC1.7 123.19,25.4
  Top 0.61: 126.05,101.6 LED186.1 | 126.05,101.6 126.37,101.6 LED186.3 | 126.05,114.3 LED185.1 | 126.05,114.3 LED185.3 | LED73.C 126.33,114.58 126.05,114.3 | LED74.C 126.33,101.88 126.05,101.6 | LED192.1 123.19,25.4 126.05,25.4 | 126.05,25.4 LED192.3 | 126.05,38.1 LED191.1 | 126.05,38.1 LED191.3 | 126.05,50.8 LED190.1 | 126.05,50.8 LED190.3 | LED78.C 126.33,51.08 126.05,50.8 | LED79.C 126.33,38.38 126.05,38.1 | LED80.C 126.33,25.68 126.05,25.4 | 126.05,88.9 LED187.1 | 126.05,88.9 126.37,88.9 LED187.3 | 126.05,76.2 LED188.1 | 126.05,76.2 LED188.3 | 126.05,63.5 LED189.1 | 126.05,63.5 LED189.3 | LED75.C 126.33,89.18 126.05,88.9 | LED76.C 126.33,76.48 126.05,76.2 | LED77.C 126.33,63.78 126.05,63.5
COL6
  Top 0.305: 115.25,114.3 117.48,114.3 118.11,113.67 118.11,101.6 | 118.11,38.1 118.11,26.04 117.48,25.4 LED184.3 | 118.11,38.1 118.11,50.8 | 118.11,50.8 118.11,63.5 | 118.11,63.5 118.11,76.2 | 118.11,76.2 118.11,88.9 | 118.11,88.9 118.11,101.6 | 118.11,101.6 115.25,101.6 | 118.11,88.9 115.25,88.9 | 118.11,88.9 | 118.11,76.2 115.25,76.2 | 118.11,76.2 | 118.11,63.5 115.25,63.5 | 118.11,63.5 | 118.11,50.8 115.25,50.8 | LED71.C 115.53,38.14 115.57,38.1 118.11,38.1
  Top 0.406: IC1.10 123.19,11.43 121.92,12.7 121.92,22.23 118.11,26.04
  Top 0.61: 115.25,101.6 LED178.1 | 115.25,101.6 LED178.3 | LED66.C 115.53,101.88 115.25,101.6 | 115.25,114.3 LED177.1 | 115.25,114.3 LED177.3 | LED65.C 115.53,114.58 115.25,114.3 | 115.25,25.4 LED184.1 | LED184.3 115.25,25.4 | 115.25,38.1 LED183.1 | 115.25,38.1 115.57,38.1 LED183.3 | 115.25,50.8 LED182.1 | 115.25,50.8 LED182.3 | LED70.C 115.53,51.08 115.25,50.8 | LED71.C 115.53,38.38 115.25,38.1 | LED72.C 115.53,25.68 115.25,25.4 | 115.25,63.5 LED181.1 | 115.25,63.5 LED181.3 | 115.25,76.2 LED180.1 | 115.25,76.2 LED180.3 | 115.25,88.9 LED179.1 | 115.25,88.9 LED179.3 | LED67.C 115.53,89.18 115.25,88.9 | LED68.C 115.53,76.48 115.25,76.2 | LED69.C 115.53,63.78 115.25,63.5
COL7
  Top 0.305: 104.46,114.3 106.68,114.3 107.31,113.67 107.31,101.6 | 107.31,38.1 107.31,26.04 106.68,25.4 LED176.3 | 107.31,38.1 107.31,50.8 | 107.31,50.8 107.31,63.5 | 107.31,63.5 107.31,76.2 | 107.31,76.2 107.31,88.9 | 107.31,88.9 107.31,101.6 | 107.31,38.1 104.46,38.1 | 107.31,38.1 | 107.31,50.8 104.46,50.8 | 107.31,50.8 | 107.31,63.5 104.46,63.5 | 107.31,76.2 104.46,76.2 | LED59.C 104.74,88.94 104.78,88.9 107.31,88.9 | LED58.C 104.74,101.64 104.78,101.6 107.31,101.6
  Top 0.406: IC1.8 120.65,21.59 118.75,23.5 109.86,23.5 107.31,26.04
  Top 0.61: 104.46,114.3 LED169.1 | 104.46,114.3 LED169.3 | LED57.C 104.74,114.58 104.46,114.3 | 104.46,101.6 LED170.1 | 104.46,101.6 104.78,101.6 LED170.3 | LED58.C 104.74,101.88 104.46,101.6 | LED176.1 104.46,25.4 | 104.46,25.4 LED176.3 | 104.46,38.1 LED175.1 | 104.46,38.1 LED175.3 | 104.46,50.8 LED174.1 | 104.46,50.8 LED174.3 | LED62.C 104.74,51.08 104.46,50.8 | LED63.C 104.74,38.38 104.46,38.1 | LED64.C 104.74,25.68 104.46,25.4 | 104.46,63.5 LED173.1 | 104.46,63.5 LED173.3 | 104.46,88.9 LED171.1 | 104.46,88.9 104.78,88.9 LED171.3 | 104.46,76.2 LED172.1 | 104.46,76.2 LED172.3 | LED59.C 104.74,89.18 104.46,88.9 | LED60.C 104.74,76.48 104.46,76.2 | LED61.C 104.74,63.78 104.46,63.5
COL8
  Top 0.305: 93.66,114.3 95.89,114.3 96.52,113.67 96.52,101.6 | 96.52,38.1 96.52,26.04 95.89,25.4 LED168.3 | 96.52,38.1 96.52,50.8 | 96.52,50.8 96.52,63.5 | 96.52,63.5 96.52,76.2 | 96.52,76.2 96.52,88.9 | 96.52,88.9 96.52,101.6 | LED168.3 | 96.52,101.6 93.66,101.6 | 96.52,88.9 93.66,88.9 | 96.52,76.2 93.66,76.2 | 96.52,63.5 93.66,63.5 | 96.52,63.5 | 96.52,50.8 93.66,50.8 | 96.52,50.8 | LED55.C 93.94,38.14 93.98,38.1 96.52,38.1
  Top 0.406: IC1.9 120.65,11.43 119.38,12.7 119.38,21.59 118.75,22.23 109.22,22.23 107.95,23.5 99.06,23.5 96.52,26.04
  Top 0.61: 93.66,101.6 LED162.1 | 93.66,101.6 LED162.3 | LED50.C 93.94,101.88 93.66,101.6 | 93.66,114.3 LED161.1 | 93.66,114.3 LED161.3 | LED49.C 93.94,114.58 93.66,114.3 | LED168.1 93.66,25.4 | 93.66,25.4 LED168.3 | 93.66,38.1 LED167.1 | 93.66,38.1 LED167.3 | 93.66,50.8 LED166.1 | 93.66,50.8 LED166.3 | LED54.C 93.94,51.08 93.66,50.8 | LED55.C 93.94,38.38 93.66,38.1 | LED56.C 93.94,25.68 93.66,25.4 | 93.66,63.5 LED165.1 | 93.66,63.5 LED165.3 | 93.66,76.2 LED164.1 | 93.66,76.2 LED164.3 | 93.66,88.9 LED163.1 | 93.66,88.9 LED163.3 | LED51.C 93.94,89.18 93.66,88.9 | LED52.C 93.94,76.48 93.66,76.2 | LED53.C 93.94,63.78 93.66,63.5
COL9
  Top 0.305: 82.87,114.3 85.09,114.3 85.73,113.67 85.73,101.6 | 85.73,38.1 85.73,26.04 85.09,25.4 LED160.3 | 85.73,38.1 85.73,50.8 | 85.73,50.8 85.73,63.5 | 85.73,63.5 85.73,76.2 | 85.73,76.2 85.73,88.9 | 85.73,88.9 85.73,101.6 | 85.73,38.1 LED159.3 | 85.73,38.1 | 85.73,50.8 82.87,50.8 | 85.73,63.5 82.87,63.5 | 85.73,76.2 82.87,76.2 | 85.73,76.2 | 85.73,101.6 82.87,101.6 | 85.73,88.9 82.87,88.9
  Top 0.406: IC2.5 42.55,17.14 46.36,20.95 55.88,20.95 57.15,22.23 66.67,22.23 67.94,23.5 77.15,23.5 LED160.1
  Top 0.61: 82.87,101.6 LED154.1 | 82.87,101.6 LED154.3 | 82.87,114.3 LED153.1 | 82.87,114.3 LED153.3 | LED41.C 83.15,114.58 82.87,114.3 | LED42.C 83.15,101.88 82.87,101.6 | 82.87,50.8 LED158.1 | 82.87,50.8 LED158.3 | 82.87,38.1 LED159.1 | LED159.3 82.87,38.1 | LED160.1 82.87,25.4 | 82.87,25.4 LED160.3 | LED46.C 83.15,51.08 82.87,50.8 | LED47.C 83.15,38.38 82.87,38.1 | LED48.C 83.15,25.68 82.87,25.4 | 82.87,63.5 LED157.1 | 82.87,63.5 LED157.3 | 82.87,88.9 LED155.1 | 82.87,88.9 LED155.3 | 82.87,76.2 LED156.1 | 82.87,76.2 LED156.3 | LED43.C 83.15,89.18 82.87,88.9 | LED44.C 83.15,76.48 82.87,76.2 | LED45.C 83.15,63.78 82.87,63.5
COL10
  Top 0.305: 72.07,114.3 74.3,114.3 74.93,113.67 74.93,101.6 | 74.93,38.1 74.93,26.04 74.3,25.4 LED152.3 | 74.93,38.1 74.93,50.8 | 74.93,50.8 74.93,63.5 | 74.93,63.5 74.93,76.2 | 74.93,76.2 74.93,88.9 | 74.93,88.9 74.93,101.6 | 74.93,101.6 72.07,101.6 | 74.93,88.9 72.07,88.9 | 74.93,88.9 | 74.93,76.2 72.07,76.2 | 74.93,76.2 | 74.93,63.5 72.07,63.5 | 74.93,63.5 | 74.93,50.8 72.07,50.8 | 74.93,50.8 | 74.93,38.1 72.39,38.1
  Top 0.406: IC2.12 42.55,11.43 41.27,12.7 41.27,17.14 46.36,22.23 55.88,22.23 57.15,23.5 66.36,23.5 LED152.1
  Top 0.61: 72.07,114.3 LED145.1 | 72.07,114.3 LED145.3 | LED33.C 72.35,114.58 72.07,114.3 | 72.07,101.6 LED146.1 | 72.07,101.6 LED146.3 | LED34.C 72.35,101.88 72.07,101.6 | 72.07,50.8 LED150.1 | 72.07,50.8 LED150.3 | 72.07,38.1 LED151.1 | 72.39,38.1 72.07,38.1 | 72.39,38.1 LED151.3 | LED152.1 72.07,25.4 | 72.07,25.4 LED152.3 | LED38.C 72.35,51.08 72.07,50.8 | 72.07,38.1 72.35,38.38 LED39.C 72.35,38.14 72.39,38.1 | LED40.C 72.35,25.68 72.07,25.4 | 72.07,63.5 LED149.1 | 72.07,63.5 LED149.3 | 72.07,76.2 LED148.1 | 72.07,76.2 LED148.3 | 72.07,88.9 LED147.1 | 72.07,88.9 LED147.3 | LED37.C 72.35,63.78 72.07,63.5 | LED36.C 72.35,76.48 72.07,76.2 | LED35.C 72.35,89.18 72.07,88.9
COL11
  Top 0.305: 61.28,114.3 63.5,114.3 64.14,113.67 64.14,101.6 | 64.14,38.1 64.14,26.04 63.5,25.4 LED144.3 | 64.14,38.1 64.14,50.8 | 64.14,50.8 64.14,63.5 | 64.14,63.5 64.14,76.2 | 64.14,76.2 64.14,88.9 | 64.14,88.9 64.14,101.6 | LED144.3 | 64.14,101.6 61.28,101.6 | 64.14,88.9 61.28,88.9 | 64.14,88.9 | 64.14,76.2 61.28,76.2 | 64.14,63.5 61.28,63.5 | 64.14,63.5 | 63.5,50.8 61.28,50.8 | 63.5,50.8 | 64.14,50.8 63.5,50.8 | LED31.C 61.56,38.14 61.59,38.1 64.14,38.1
  Top 0.406: IC2.6 40,17.14 46.36,23.5 55.56,23.5 LED144.1
  Top 0.61: 61.28,114.3 LED137.1 | 61.28,114.3 LED137.3 | LED25.C 61.56,114.58 61.28,114.3 | 61.28,101.6 LED138.1 | 61.28,101.6 LED138.3 | LED26.C 61.56,101.88 61.28,101.6 | 61.28,50.8 LED142.1 | 61.28,50.8 LED142.3 | LED144.1 61.28,25.4 | 61.28,25.4 LED144.3 | 61.28,38.1 LED143.1 | 61.28,38.1 LED143.3 | LED30.C 61.56,51.08 61.28,50.8 | LED31.C 61.56,38.38 61.28,38.1 | LED32.C 61.56,25.68 61.28,25.4 | 61.28,88.9 LED139.1 | 61.28,88.9 LED139.3 | 61.28,76.2 LED140.1 | 61.28,76.2 LED140.3 | 61.28,63.5 LED141.1 | 61.28,63.5 LED141.3 | LED27.C 61.56,89.18 61.28,88.9 | LED28.C 61.56,76.48 61.28,76.2 | LED29.C 61.56,63.78 61.28,63.5
COL12
  Top 0.305: 50.48,114.3 52.7,114.3 53.34,113.67 53.34,101.6 | 53.34,38.1 53.34,26.04 52.7,25.4 LED136.3 | 53.34,38.1 53.34,50.8 | 53.34,50.8 53.34,63.5 | 53.34,63.5 53.34,76.2 | 53.34,76.2 53.34,88.9 | 53.34,88.9 53.34,101.6 | 53.34,101.6 50.48,101.6 | 53.34,101.6 | 53.34,88.9 50.48,88.9 | 53.34,88.9 | 53.34,76.2 50.48,76.2 | 53.34,76.2 | 53.34,63.5 50.48,63.5 | 53.34,63.5 | 53.34,50.8 50.48,50.8 | 53.34,50.8 | LED23.C 50.76,38.14 50.8,38.1 53.34,38.1
  Top 0.406: IC2.11 40,11.43 38.73,12.7 38.73,17.46 LED136.1
  Top 0.61: 50.48,114.3 LED129.1 | 50.48,114.3 LED129.3 | LED17.C 50.76,114.58 50.48,114.3 | 50.48,101.6 LED130.1 | 50.48,101.6 LED130.3 | LED18.C 50.76,101.88 50.48,101.6 | 50.48,50.8 LED134.1 | 50.48,50.8 LED134.3 | LED136.1 50.48,25.4 | 50.48,25.4 LED136.3 | 50.48,38.1 LED135.1 | 50.48,38.1 LED135.3 | LED22.C 50.76,51.08 50.48,50.8 | LED23.C 50.76,38.38 50.48,38.1 | LED24.C 50.76,25.68 50.48,25.4 | 50.48,88.9 LED131.1 | 50.48,88.9 LED131.3 | 50.48,76.2 LED132.1 | 50.48,76.2 LED132.3 | 50.48,63.5 LED133.1 | 50.48,63.5 LED133.3 | LED19.C 50.76,89.18 50.48,88.9 | LED20.C 50.76,76.48 50.48,76.2 | LED21.C 50.76,63.78 50.48,63.5
COL13
  Top 0.305: 39.69,114.3 41.91,114.3 42.55,113.67 42.55,101.6 | 42.55,38.1 42.55,26.04 41.91,25.4 LED128.3 | 42.55,38.1 42.55,50.8 | 42.55,50.8 42.55,63.5 | 42.55,63.5 42.55,76.2 | 42.55,76.2 42.55,88.9 | 42.55,88.9 42.55,101.6 | 42.55,50.8 40,50.8 | LED15.C 39.97,38.14 40,38.1 42.55,38.1 | 42.55,63.5 39.69,63.5 | 42.55,63.5 | 42.55,76.2 39.69,76.2 | 42.55,76.2 | LED11.C 39.97,88.94 40,88.9 42.55,88.9 | LED10.C 39.97,101.64 40,101.6 42.55,101.6
  Top 0.406: IC2.7 37.47,25.4
  Top 0.61: 39.69,114.3 LED121.1 | 39.69,114.3 LED121.3 | LED9.C 39.97,114.58 39.69,114.3 | 39.69,101.6 LED122.1 | 39.69,101.6 LED122.3 | LED10.C 39.97,101.88 39.69,101.6 | 39.69,50.8 LED126.1 | 40,50.8 39.69,50.8 | 40,50.8 LED126.3 | LED128.1 37.47,25.4 39.69,25.4 | 39.69,25.4 LED128.3 | 39.69,38.1 LED127.1 | 39.69,38.1 40,38.1 LED127.3 | 39.69,50.8 39.97,51.08 LED14.C 39.97,50.84 40,50.8 | LED15.C 39.97,38.38 39.69,38.1 | LED16.C 39.97,25.68 39.69,25.4 | 39.69,88.9 LED123.1 | 39.69,88.9 LED123.3 | 39.69,76.2 LED124.1 | 39.69,76.2 LED124.3 | 39.69,63.5 LED125.1 | 39.69,63.5 LED125.3 | LED11.C 39.97,89.18 39.69,88.9 | LED12.C 39.97,76.48 39.69,76.2 | LED13.C 39.97,63.78 39.69,63.5
COL14
  Top 0.305: 28.89,114.3 30.48,114.3 30.48,108.59 31.75,107.31 31.75,101.6 | 31.75,50.8 31.75,63.5 | 31.75,63.5 31.75,76.2 | 31.75,76.2 31.75,88.9 | 31.75,88.9 31.75,101.6 | LED120.3 31.12,25.4 31.75,26.04 31.75,31.12 30.48,32.38 30.48,37.78 LED119.3 31.12,38.1 31.75,38.73 31.75,50.8 | LED120.3 | 31.75,63.5 28.89,63.5 | 31.75,50.8 29.21,50.8 | LED7.C 29.17,38.14 29.21,38.1 | 31.75,76.2 28.89,76.2 | 31.75,76.2 | 31.75,101.6 28.89,101.6 | 31.75,88.9 28.89,88.9
  Top 0.406: IC2.10 37.47,11.43 36.2,12.7 36.2,21.59 31.75,26.04
  Top 0.61: 28.89,114.3 LED113.1 | 28.89,114.3 LED113.3 | LED1.C 29.17,114.58 28.89,114.3 | 28.89,101.6 LED114.1 | 28.89,101.6 LED114.3 | LED2.C 29.17,101.88 28.89,101.6 | 28.89,50.8 LED118.1 | 29.21,50.8 28.89,50.8 | 29.21,50.8 LED118.3 | 28.89,25.4 LED120.1 | LED120.3 28.89,25.4 | 28.89,38.1 LED119.1 | 28.89,38.1 29.21,38.1 LED119.3 | 28.89,50.8 29.17,51.08 LED6.C 29.17,50.84 29.21,50.8 | LED7.C 29.17,38.38 28.89,38.1 | LED8.C 29.17,25.68 28.89,25.4 | 28.89,88.9 LED115.1 | 28.89,88.9 LED115.3 | 28.89,76.2 LED116.1 | 28.89,76.2 LED116.3 | 28.89,63.5 LED117.1 | 28.89,63.5 LED117.3 | LED3.C 29.17,89.18 28.89,88.9 | LED4.C 29.17,76.48 28.89,76.2 | LED5.C 29.17,63.78 28.89,63.5
COL15  (12 unrouted)
GND  (12 unrouted)
  pour Bottom (isolate 0.406): 20.32,21.59 175.26,21.59 175.26,-1.27 20.32,-1.27
  pour Top (isolate 0.406): 20.32,21.59 175.26,21.59 175.26,-1.27 20.32,-1.27
INT  (2 unrouted)
LIGHTSENSOR  (1 unrouted)
LOAD  (via drill 0.5)
  Top 0.406: v130.81,13.02 IC1.4 | v45.09,13.33 IC2.4 | v103.51,12.7 IC4.15
  Bottom 0.254: v45.09,13.33 46.36,12.06 48.26,12.06 48.89,12.7 92.55,12.7 92.87,12.38 93.82,12.38 94.14,12.7 97.47,12.7 97.79,13.02 101.76,13.02 102.08,12.7 v103.51,12.7 110.33,12.7 110.65,13.02 111.44,13.02 112.08,12.38 112.87,12.38 113.19,12.7 130.49,12.7 v130.81,13.02
MISO
  Top 0.406: JP1.1 114.94,17.14 113.03,19.05 98.42,19.05 95.89,16.51 IC4.18
MOSI  (via drill 0.5)
  Top 0.406: v135.89,12.06 IC1.2 | v98.42,12.06 IC4.17 | JP1.4 111.12,4.45 v111.12,12.06
  Bottom 0.254: v98.42,12.06 100.17,12.06 100.49,12.38 101.44,12.38 101.76,12.06 102.71,12.06 103.03,11.75 103.98,11.75 104.3,12.06 v111.12,12.06 111.28,12.06 111.6,11.75 113.19,11.75 113.51,12.06 v135.89,12.06
N$1  (2 unrouted)
N$2  (1 unrouted)
N$3
  Bottom 0.406: IC4.9 90.81,4.95 Q10.1 88.39,2.54 C3.1
N$4
  Bottom 0.406: C4.1 95.76,2.54 Q10.2 93.34,4.95 IC4.10
N$5  (via drill 0.5)
  Top 0.406: v50.16,10.79 IC2.2 | v133.35,10.79 IC1.14
  Bottom 0.254: v50.16,10.79 97.31,10.79 97.63,10.48 104.62,10.48 104.93,10.79 110.01,10.79 110.33,10.48 113.82,10.48 114.14,10.79 129.7,10.79 130.33,10.16 131.29,10.16 131.92,10.79 v133.35,10.79
N$6
  Top 0.406: IC2.15 50.16,6.35 R10.2
N$7
  Top 0.406: IC1.15 135.89,6.35 R9.2
N$10
  Bottom 0.406: R8.2 14.61,119.38 Q2.2
N$11
  Bottom 0.406: R7.2 14.61,106.68 Q3.2
N$12
  Bottom 0.406: R6.2 14.61,93.98 Q4.2
N$13
  Bottom 0.406: R5.2 14.61,81.28 Q5.2
N$14
  Bottom 0.406: R4.2 17.14,68.58 Q6.2
N$15  (1 unrouted)
N$16
  Bottom 0.406: R3.2 14.61,55.88 Q7.2
N$17
  Bottom 0.406: R2.2 14.61,43.18 Q8.2
N$18
  Bottom 0.406: R1.2 14.61,30.48 Q9.2
N$19
  Bottom 0.406: IC3.7 5.71,68.58 9.53,64.77 9.53,27.94 R1.1
N$20
  Bottom 0.406: IC3.9 11.43,38.73 R2.1
N$21
  Bottom 0.406: IC3.10 12.7,68.58 13.33,67.94 13.33,49.53 R3.1
N$22
  Bottom 0.406: R4.1 14.61,69.22 12.7,71.12 IC3.11
N$23
  Bottom 0.406: IC3.12 R5.1
N$24
  Bottom 0.406: IC3.13 12.7,76.2 13.33,76.83 13.33,85.09 R6.1
N$25  (via drill 0.5)
  Top 0.406: v8.25,99.06 R7.1
  Bottom 0.406: IC3.14 10.16,78.74 8.25,80.64 v8.25,99.06
N$26
  Bottom 0.406: IC3.15 10.16,81.28 9.53,81.92 9.53,106.68 R8.1
N$37  (2 unrouted)
N$54
  Bottom 0.813: IC4.21 C5.1
N$55  (2 unrouted)
N$56  (1 unrouted)
N$57  (2 unrouted)
N$58  (1 unrouted)
RESET  (1 unrouted)
  Bottom 0.406: 66.67,8.25 64.77,8.25 C9.2 | 66.67,8.25 IC4.1 | 66.67,8.25 R19.1
ROW1  (3 unrouted)
  Top 0.61: LED17.A 47.66,118.39 LED129.2 | LED25.A 58.46,118.39 LED137.2 | LED9.A 36.87,118.39 LED121.2 | LED1.A 26.07,118.39 LED113.2 | LED33.A 69.25,118.39 LED145.2 | LED41.A 80.05,118.39 LED153.2 | LED49.A 90.84,118.39 LED161.2 | LED57.A 101.64,118.39 LED169.2 | LED65.A 112.43,118.39 LED177.2 | LED73.A 123.23,118.39 LED185.2 | LED81.A 134.02,118.39 LED193.2 | LED89.A 144.82,118.39 LED201.2 | LED105.A 166.41,118.39 LED217.2 | LED97.A 155.61,118.39 LED209.2
  Bottom 0.61: LED201.2 LED193.4 LED193.2 | LED193.2 LED185.4 LED185.2 | LED185.2 LED169.4 LED169.2 | LED169.2 LED153.4 LED153.2 | LED153.2 LED121.4 LED121.2 | LED209.2 LED217.2 LED217.4 | LED209.2 LED209.4 | LED201.2 LED209.2 | LED201.2 | LED193.2 LED201.2 | LED193.2 | LED193.2 LED185.2 | LED185.2 LED177.2 | LED177.2 | LED169.2 LED177.2 | LED169.2 | LED169.2 LED161.4 LED161.2 LED153.2 | LED153.2 | LED153.2 LED145.4 LED145.2 LED137.4 LED137.2 LED129.4 LED129.2 LED121.2 | LED121.2 LED113.4 LED113.2 20.32,119.38 Q2.1 | LED177.2 LED177.4 | LED201.2 LED201.4
ROW2  (3 unrouted)
  Top 0.61: LED90.A 144.82,105.69 LED202.2 | LED82.A 134.02,105.69 LED194.2 | LED74.A 123.23,105.69 LED186.2 | LED66.A 112.43,105.69 LED178.2 | LED58.A 101.64,105.69 LED170.2 | LED50.A 90.84,105.69 LED162.2 | LED42.A 80.05,105.69 LED154.2 | LED34.A 69.25,105.69 LED146.2 | LED26.A 58.46,105.69 LED138.2 | LED18.A 47.66,105.69 LED130.2 | LED10.A 36.87,105.69 LED122.2 | LED2.A 26.07,105.69 LED114.2 | LED98.A 155.61,105.69 LED210.2 | LED106.A 166.41,105.69 LED218.2
  Bottom 0.61: LED202.2 LED186.4 LED186.2 | LED186.2 LED178.4 LED178.2 | LED178.2 LED170.4 LED170.2 | LED202.2 LED210.2 LED210.4 LED218.2 LED218.4 | LED202.2 LED194.2 | LED186.2 LED194.2 | LED186.2 | LED178.2 LED186.2 | LED178.2 | LED170.2 LED178.2 | LED170.2 | LED170.2 LED162.4 LED162.2 LED154.4 LED154.2 LED146.4 LED146.2 LED138.4 | LED114.2 LED122.2 LED122.4 | LED114.2 | LED202.2 LED202.4 | LED194.2 LED194.4 | LED130.4 47.62,106.68 47.15,106.2 LED130.2 LED138.2 LED114.4 LED114.2 | LED114.2 20.32,106.68 Q3.1
  Bottom 0.813: LED138.2 LED138.4
ROW3  (3 unrouted)
  Top 0.61: LED3.A 26.07,92.99 LED115.2 | LED11.A 36.87,92.99 LED123.2 | LED19.A 47.66,92.99 LED131.2 | LED27.A 58.46,92.99 LED139.2 | LED35.A 69.25,92.99 LED147.2 | LED43.A 80.05,92.99 LED155.2 | LED51.A 90.84,92.99 LED163.2 | LED59.A 101.64,92.99 LED171.2 | LED67.A 112.43,92.99 LED179.2 | LED75.A 123.23,92.99 LED187.2 | LED83.A 134.02,92.99 LED195.2 | LED91.A 144.82,92.99 LED203.2 | LED99.A 155.61,92.99 LED211.2 | LED107.A 166.41,92.99 LED219.2
  Bottom 0.61: LED211.2 LED203.4 LED203.2 | LED203.2 LED187.4 LED187.2 | LED187.2 LED171.4 LED171.2 | LED171.2 LED163.4 LED163.2 | LED163.2 LED155.4 LED155.2 | LED155.2 LED115.4 LED115.2 20.32,93.98 Q4.1 | LED219.2 | LED211.2 LED219.2 | LED211.2 | LED203.2 LED211.2 | LED203.2 | LED203.2 LED195.4 LED195.2 LED187.2 | LED187.2 | LED187.2 LED179.4 LED179.2 LED171.2 | LED171.2 | LED163.2 LED171.2 | LED163.2 | LED155.2 LED163.2 | LED155.2 | LED155.2 LED147.2 | LED147.2 LED139.4 LED139.2 LED131.4 LED131.2 LED123.4 LED123.2 | LED219.2 LED219.4 | LED211.2 LED211.4 | LED147.2 LED147.4
ROW4  (3 unrouted)
  Top 0.61: LED28.A 58.46,80.29 LED140.2 | LED20.A 47.66,80.29 LED132.2 | LED12.A 36.87,80.29 LED124.2 | LED4.A 26.07,80.29 LED116.2 | LED36.A 69.25,80.29 LED148.2 | LED44.A 80.05,80.29 LED156.2 | LED52.A 90.84,80.29 LED164.2 | LED60.A 101.64,80.29 LED172.2 | LED68.A 112.43,80.29 LED180.2 | LED76.A 123.23,80.29 LED188.2 | LED84.A 134.02,80.29 LED196.2 | LED92.A 144.82,80.29 LED204.2 | LED100.A 155.61,80.29 LED212.2 | LED108.A 166.41,80.29 LED220.2
  Bottom 0.61: LED124.2 LED116.4 LED116.2 20.32,81.28 Q5.1 | LED132.2 LED124.4 LED124.2 | LED180.2 LED156.4 LED156.2 LED148.4 LED148.2 LED132.4 LED132.2 | LED220.2 LED180.4 LED180.2 | LED220.2 LED212.2 | LED204.4 LED204.2 | LED212.2 LED204.4 | LED204.2 LED196.4 LED196.2 LED188.4 LED188.2 LED180.2 | LED180.2 | LED180.2 LED172.4 LED172.2 LED164.4 LED164.2 | LED132.2 LED140.2 LED140.4 | LED132.2 | LED132.2 LED124.2 | LED220.2 LED220.4 | LED212.2 LED212.4 | LED204.4 144.78,81.28 144.3,80.8 LED204.2
ROW5
  Top 0.61: LED109.A 166.41,67.59 LED221.2 | LED101.A 155.61,67.59 LED213.2 | LED93.A 144.82,67.59 LED205.2 | LED85.A 134.02,67.59 LED197.2 | LED77.A 123.23,67.59 LED189.2 | LED69.A 112.43,67.59 LED181.2 | LED61.A 101.64,67.59 LED173.2 | LED53.A 90.84,67.59 LED165.2 | LED45.A 80.05,67.59 LED157.2 | LED37.A 69.25,67.59 LED149.2 | LED5.A 26.07,67.59 LED117.2 | LED13.A 36.87,67.59 LED125.2 | LED21.A 47.66,67.59 LED133.2 | LED29.A 58.46,67.59 LED141.2
  Bottom 0.61: LED157.2 LED117.4 LED117.2 20.32,68.58 Q6.1 | LED173.2 LED157.4 LED157.2 | 112.4,68.58 LED173.4 LED173.2 | 112.4,68.58 LED189.2 | LED197.2 LED189.4 LED189.2 | LED221.2 LED197.4 LED197.2 | LED221.2 LED213.2 | LED213.2 LED205.4 LED205.2 LED197.2 | LED197.2 | LED189.2 LED197.2 | LED189.2 | LED181.4 LED181.2 LED173.2 | LED181.4 LED189.2 | LED173.2 | LED173.2 LED165.4 LED165.2 LED157.2 | LED157.2 | LED157.2 LED149.4 LED149.2 LED141.4 LED141.2 LED133.4 LED133.2 LED125.4 LED125.2 | LED181.4 112.4,68.58 | 112.4,68.58 | LED221.2 LED221.4 | LED213.2 LED213.4
ROW6
  Top 0.61: LED110.A 166.41,54.89 LED222.2 | LED102.A 155.61,54.89 LED214.2 | LED94.A 144.82,54.89 LED206.2 | LED86.A 134.02,54.89 LED198.2 | LED78.A 123.23,54.89 LED190.2 | LED70.A 112.43,54.89 LED182.2 | LED62.A 101.64,54.89 LED174.2 | LED54.A 90.84,54.89 LED166.2 | LED46.A 80.05,54.89 LED158.2 | LED38.A 69.25,54.89 LED150.2 | LED30.A 58.46,54.89 LED142.2 | LED22.A 47.66,54.89 LED134.2 | LED14.A 36.87,54.89 LED126.2 | LED6.A 26.07,54.89 LED118.2
  Bottom 0.61: LED118.2 LED134.2 | LED142.2 LED134.4 LED134.2 | LED150.2 LED142.4 LED142.2 | LED166.2 LED150.4 LED150.2 | LED174.2 LED166.4 LED166.2 | LED190.2 LED174.4 LED174.2 | LED222.2 LED190.4 LED190.2 | LED118.2 | LED222.2 LED214.2 | LED214.2 | LED214.2 LED206.4 LED206.2 LED198.4 LED198.2 LED190.2 | LED190.2 | LED190.2 LED182.4 LED182.2 LED174.2 | LED174.2 | LED166.2 LED174.2 | LED166.2 | LED166.2 LED158.4 LED158.2 LED150.2 | LED150.2 | LED142.2 LED150.2 | LED142.2 | LED134.2 LED142.2 | LED134.2 | LED134.2 LED126.4 LED126.2 | LED118.2 LED118.4 | LED214.2 LED214.4 | LED222.2 LED222.4 | LED118.2 20.32,55.88 Q7.1
ROW7
  Top 0.61: LED7.A 26.07,42.19 LED119.2 | LED15.A 36.87,42.19 LED127.2 | LED23.A 47.66,42.19 LED135.2 | LED31.A 58.46,42.19 LED143.2 | LED39.A 69.25,42.19 LED151.2 | LED47.A 80.05,42.19 LED159.2 | LED55.A 90.84,42.19 LED167.2 | LED63.A 101.64,42.19 LED175.2 | LED71.A 112.43,42.19 LED183.2 | 123.23,42.19 LED79.A | LED191.2 123.23,42.19 | LED87.A 134.02,42.19 LED199.2 | LED95.A 144.82,42.19 LED207.2 | LED103.A 155.61,42.19 LED215.2 | LED111.A 166.41,42.19 LED223.2 | 123.23,42.19 123.23,42.51 122.56,43.18
  Bottom 0.61: LED127.2 LED119.4 LED119.2 20.32,43.18 Q8.1 | LED183.2 LED151.4 LED151.2 | 123.19,43.18 LED183.4 LED183.2 | 123.19,43.18 LED199.2 | LED215.2 LED199.4 LED199.2 | LED223.2 LED215.4 LED215.2 | LED223.2 | LED215.2 LED223.2 | LED215.2 | LED215.2 LED207.4 LED207.2 LED199.2 | LED199.2 | LED191.4 LED191.2 LED183.2 | LED191.4 LED199.2 | LED183.2 | LED183.2 LED175.4 LED175.2 LED167.4 LED167.2 LED159.4 LED159.2 LED151.2 | LED151.2 | LED151.2 LED143.4 LED143.2 LED135.4 LED135.2 LED127.2 | LED191.4 123.19,43.18 | 123.19,43.18 | LED127.2 LED127.4 | LED223.2 LED223.4
ROW8
  Top 0.61: LED8.A 26.07,29.49 LED120.2 | LED16.A 36.87,29.49 LED128.2 | LED24.A 47.66,29.49 LED136.2 | LED32.A 58.46,29.49 LED144.2 | LED40.A 69.25,29.49 LED152.2 | LED48.A 80.05,29.49 LED160.2 | LED56.A 90.84,29.49 LED168.2 | LED64.A 101.64,29.49 LED176.2 | LED72.A 112.43,29.49 LED184.2 | LED80.A 123.23,29.49 LED192.2 | LED88.A 134.02,29.49 LED200.2 | LED96.A 144.82,29.49 LED208.2 | LED104.A 155.61,29.49 LED216.2 | LED112.A 166.41,29.49 LED224.2
  Bottom 0.61: LED120.2 LED136.2 | LED152.2 LED136.4 LED136.2 | LED176.2 LED152.4 LED152.2 | LED184.2 LED176.4 LED176.2 | 144.78,30.48 LED184.4 LED184.2 | 144.78,30.48 LED224.2 | LED120.2 | LED224.2 LED216.2 | LED216.2 | LED208.4 LED216.2 | LED208.4 LED208.2 LED200.4 LED200.2 LED192.4 LED192.2 LED184.2 | LED184.2 | LED176.2 LED184.2 | LED176.2 | LED176.2 LED168.4 LED168.2 LED160.4 LED160.2 LED152.2 | LED152.2 | LED152.2 LED144.4 LED144.2 LED136.2 | LED136.2 | LED136.2 LED128.4 LED128.2 | LED120.2 LED120.4 | LED224.2 LED224.4 | LED216.2 LED216.4 | 144.78,30.48 LED208.4 | 144.78,30.48 | LED120.2 20.32,30.48 Q9.1
RXD
  Bottom 0.406: IC4.2 73.03,6.98 72.23,6.19 70.33,6.19 X5.4
SCK  (via drill 0.5)
  Top 0.406: v47.62,13.33 IC2.3 | v133.35,13.33 IC1.3 | v112.4,13.33 JP1.3 | v93.34,13.33 IC4.19
  Bottom 0.254: v47.62,13.33 v93.34,13.33 97.16,13.33 97.47,13.65 104.14,13.65 104.46,13.33 110.01,13.33 110.33,13.65 111.76,13.65 112.08,13.33 v112.4,13.33 129.7,13.33 130.33,13.97 131.29,13.97 131.92,13.33 v133.35,13.33
SCL  (2 unrouted)
SDA  (2 unrouted)
TXD
  Bottom 0.406: X5.5 72.07,5.4 73.98,5.4 75.56,6.98 IC4.3

## Text on the board
bNames: SURREALITYLABS WORD CLOCK | VERSION 1